# EasyEDA Pro project Demo.eprj

# Schematic Schematic1
Board Name: Board1; Create Date: 2024-12-16; Page Name: P1; Project Name: Demo; Schematic Name: Schematic1; Update Date: 2024-12-16; Company: EasyEDA.com; Page Size: A4; Version: V1.0
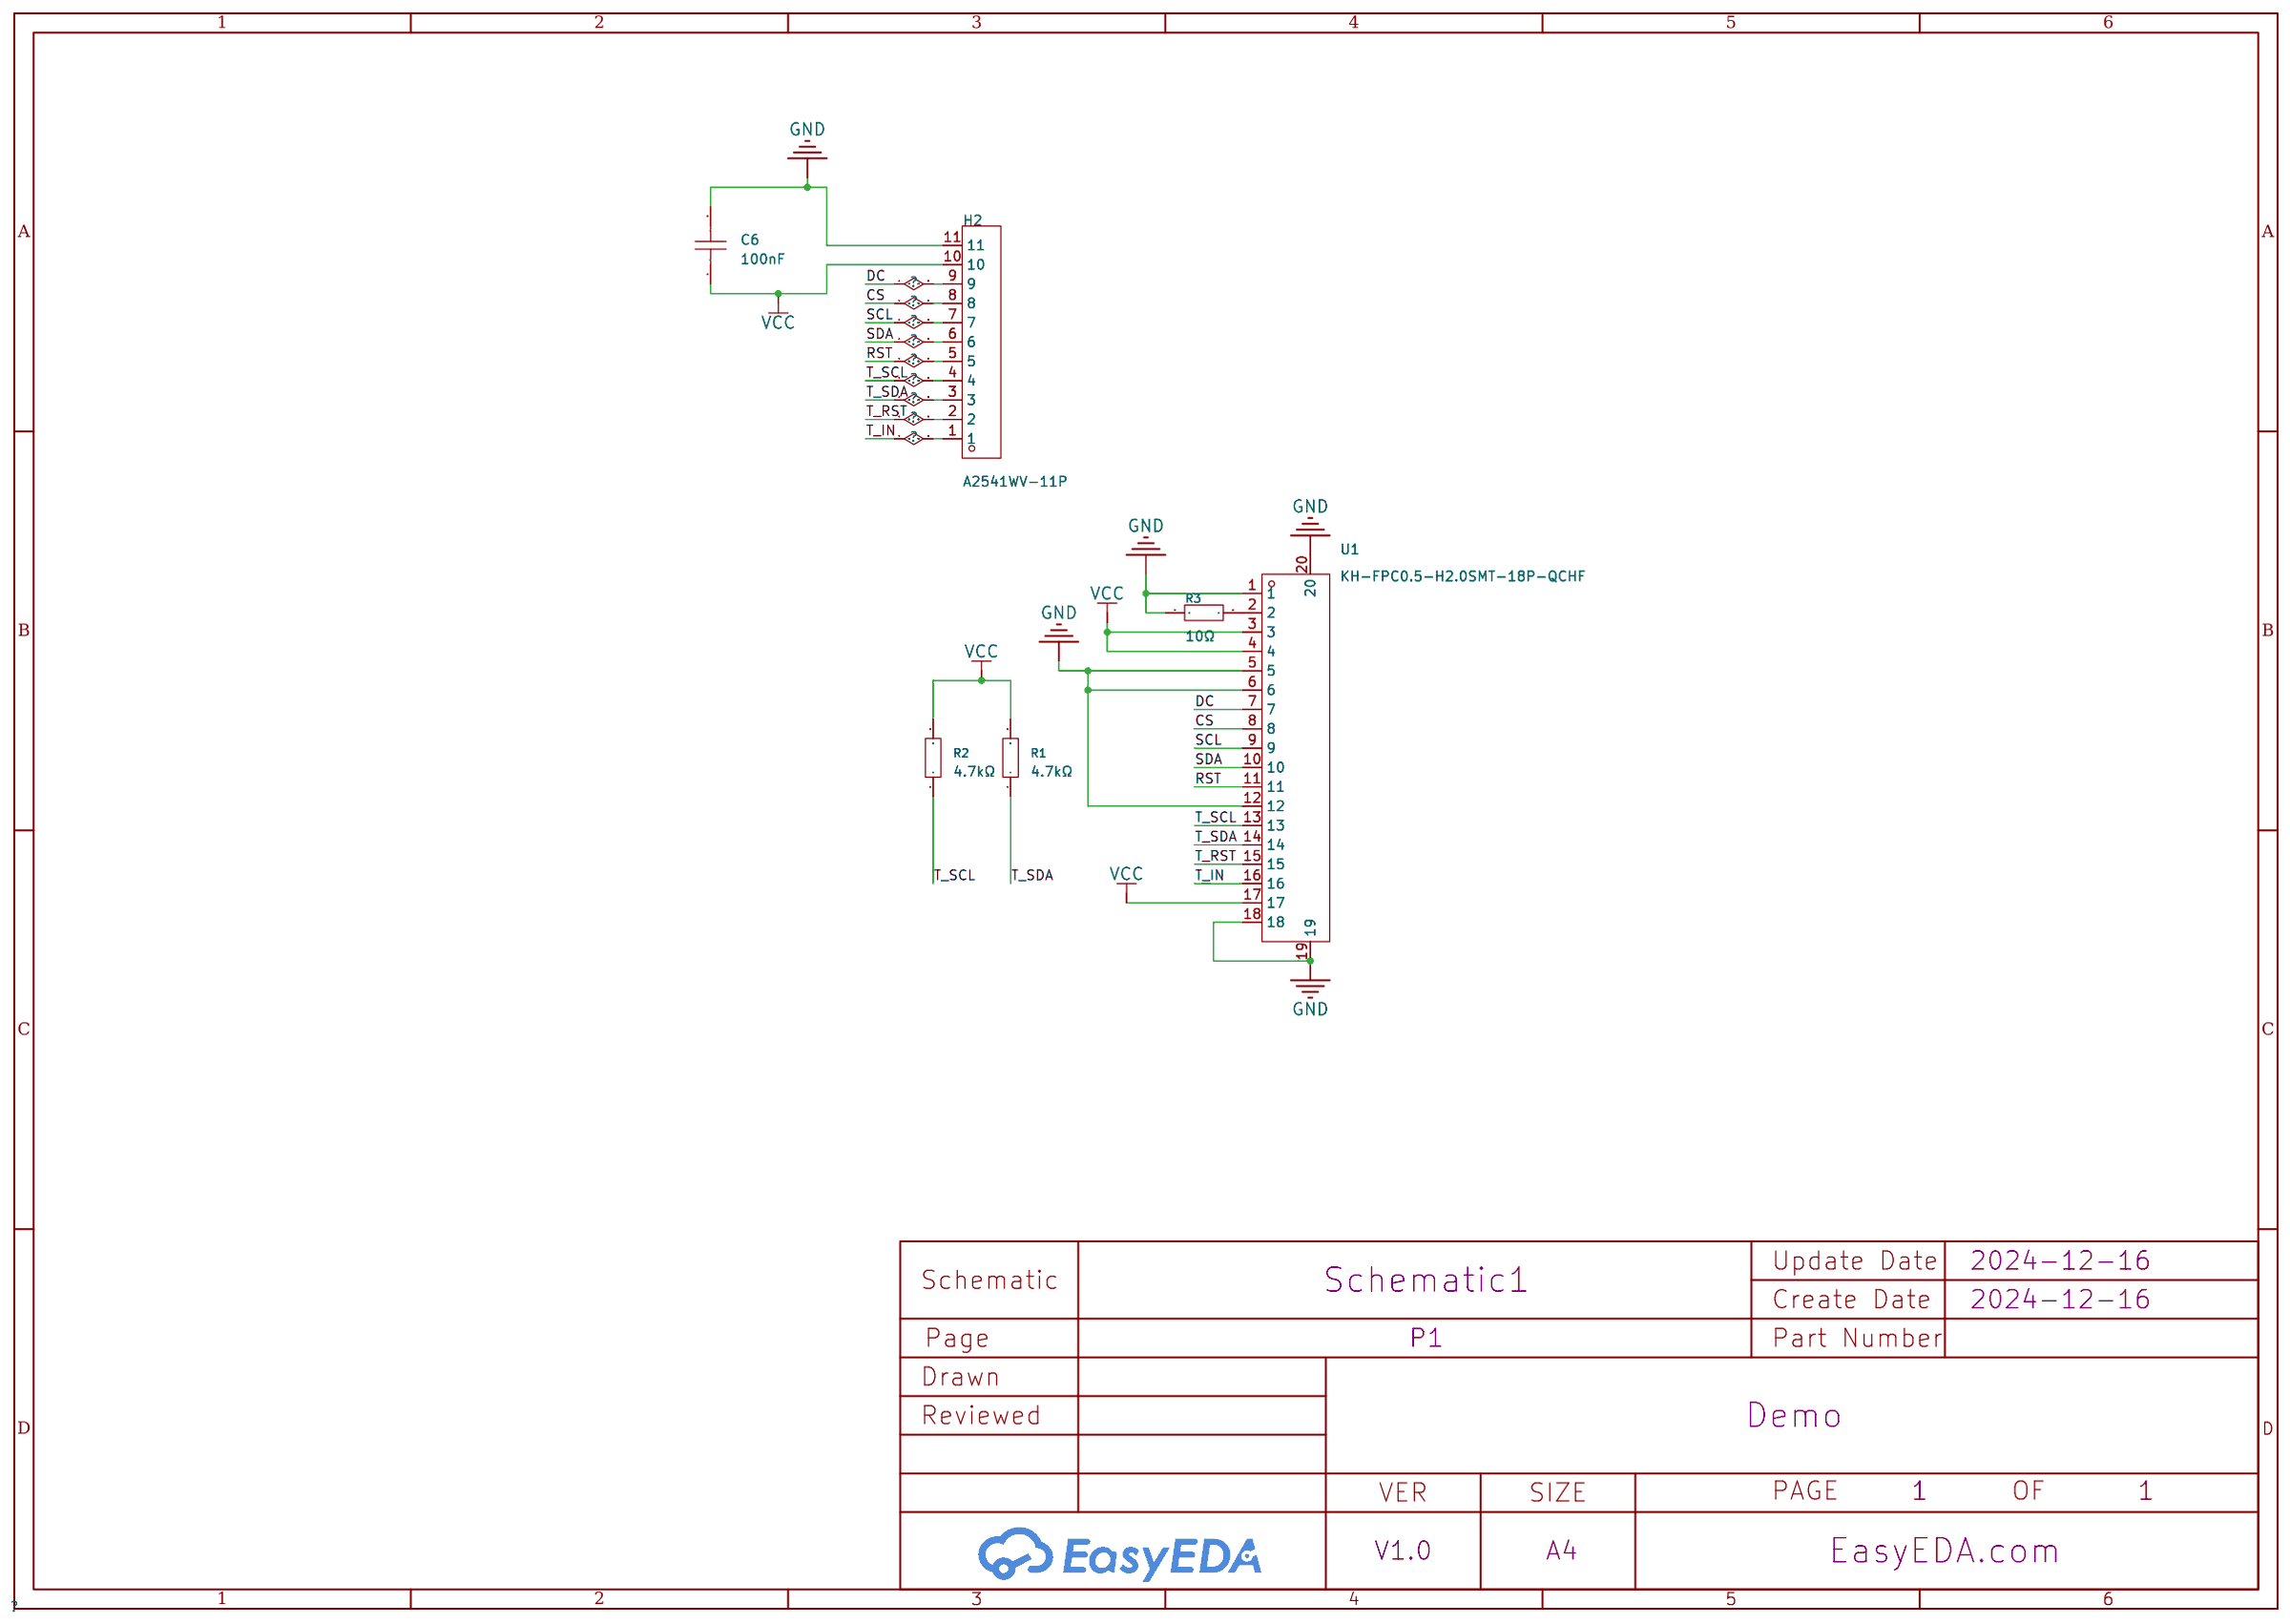
[diagram p0: schematic sheet]

## Parts
C6  100nF  [C0603]
H2  A2541WV-11P  [HDR-TH_11P-P2.54-V-M]
R1  4.7kΩ  [R0603]
R2  4.7kΩ  [R0603]
R3  10Ω  [R0402]
U1  KH-FPC0.5-H2.0SMT-18P-QCHF  [FPC-SMD_18P-P0.50_HDGC_0.5K-DX-18PWBG]

## Library data of the parts
C6 = CGA0603X7R104K500JT: Capacitance:100nF Tolerance:±10% Tolerance:±10% Voltage Rated:50V Temperature Coefficient:; LCSC Part Name: 100nF ±10% 50V; Supplier Part: C6119867; Manufacturer: HRE(芯声); Supplier Footprint: 0603; JLCPCB Part Class: Extended Part; Supplier: LCSC; Tolerance: ±10%; Voltage Rated: 50V
H2 = A2541WV-11P: LCSC Part Name: 1x11P 间距:2.54mm 方针 直插; Supplier Part: C225486; Manufacturer: CJT(长江连接器); Supplier Footprint: 插件,P=2.54mm; JLCPCB Part Class: Extended Part; Datasheet: https://atta.szlcsc.com/upload/public/pdf/source/20180724/C239359_48B1BC0CA1B4E4396A63955AAFD15564.pdf; Supplier: LCSC; Pin Structure: 1x11P; Pitch: 2.54mm; Circluar Pins/Square Pins: Square Pins; Mounting Type: Straight; Number of Rows: Plugin; Number of Pins: 11P; Current Rating (Max): 3A; Voltage Rating (Max): 250V; Length of Mating Pin: 6mm; Insulation Height: 2.54mm; Length of End Connection Pin: 3mm; Contact Plating: Gold; Operating Temperature Range: -40℃~+105℃; Color: Black
R1 R2 = RTT03472JTP: Type:Thick Film Resistors Resistance: Tolerance:±5% Tolerance:±5% Power(Watts): Overload Voltage (Max): Temperature Coefficient:±100ppm/℃ Temperature Coefficient:±100ppm/℃ Operating Temperature Range:-55℃~+155℃ Operating Temperature Range:-55℃~+155℃; LCSC Part Name: 厚膜电阻 4.7kΩ ±5% 100mW; Supplier Part: C103662; Manufacturer: RALEC(旺诠); Supplier Footprint: 0603; JLCPCB Part Class: Extended Part; Datasheet: https://atta.szlcsc.com/upload/public/pdf/source/20191219/C158410_884373A5B7E1BC76BF57BC45A946C093.pdf; Supplier: LCSC; Type: Thick Film Resistors; Tolerance: ±5%; Temperature Coefficient: ±100ppm/℃; Operating Temperature Range: -55℃~+155℃
R3 = RTT02100JTH: LCSC Part Name: 厚膜电阻 10Ω ±5% 62.5mW; Supplier Part: C102753; Manufacturer: RALEC(旺诠); Supplier Footprint: 0402; JLCPCB Part Class: Extended Part; Datasheet: https://atta.szlcsc.com/upload/public/pdf/source/20191219/C158410_884373A5B7E1BC76BF57BC45A946C093.pdf; Supplier: LCSC; Type: Thick Film Resistors; Tolerance: ±5%; Temperature Coefficient: ±100ppm/℃; Operating Temperature Range: -55℃~+155℃
U1 = KH-FPC0.5-H2.0SMT-18P-QCHF: Supplier Part: C3249996; Manufacturer: kinghelm(金航标); Supplier Footprint: SMD,P=0.5mm; JLCPCB Part Class: Extended Part; Datasheet: https://atta.szlcsc.com/upload/public/pdf/source/20220629/0C8C5329E03AE4678B0B24A2A81D42D9.pdf; Supplier: LCSC; Locking Feature: Clamshell; Number of Contacts: 18P; Pitch: 0.5mm; Height Above Board: 2mm

## Nets
GND: C6.2 H2.11 R3.1 U1.1 U1.5 U1.6 U1.12 U1.18 U1.19 U1.20
VCC: C6.1 H2.10 R1.2 R2.2 U1.3 U1.4 U1.17
CS: H2.8 U1.8
DC: H2.9 U1.7
RST: H2.5 U1.11
SCL: H2.7 U1.9
SDA: H2.6 U1.10
T_IN: H2.1 U1.16
T_RST: H2.2 U1.15
T_SCL: H2.4 R2.1 U1.13
T_SDA: H2.3 R1.1 U1.14
Net-(R3-2): R3.2 U1.2

# Board PCB1
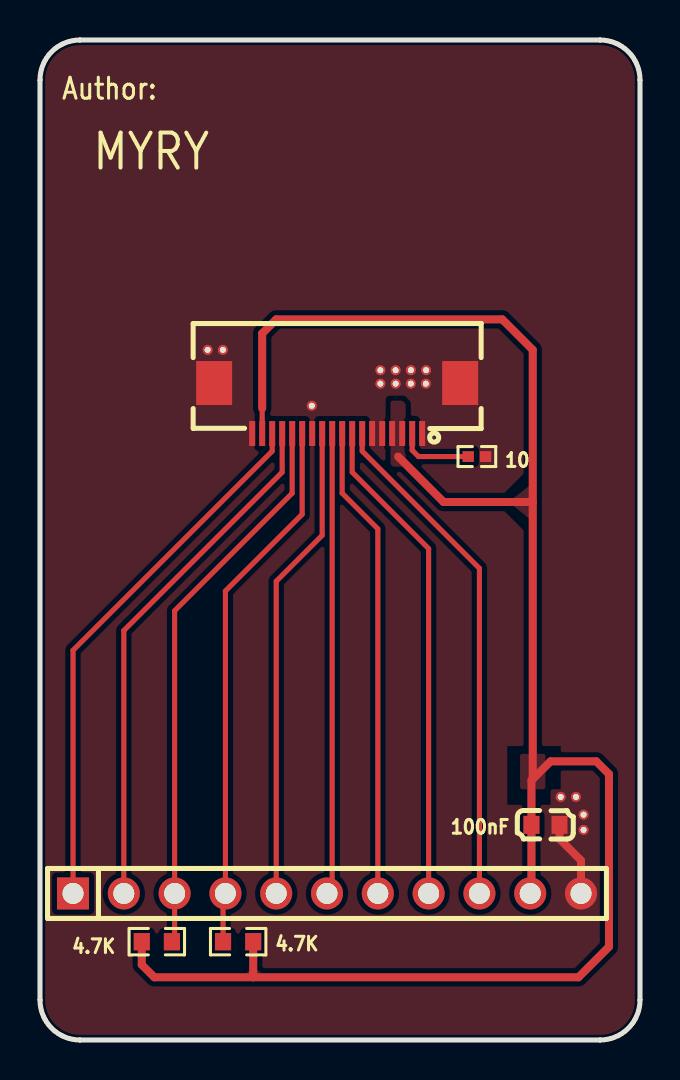
[diagram p1: board, top side]
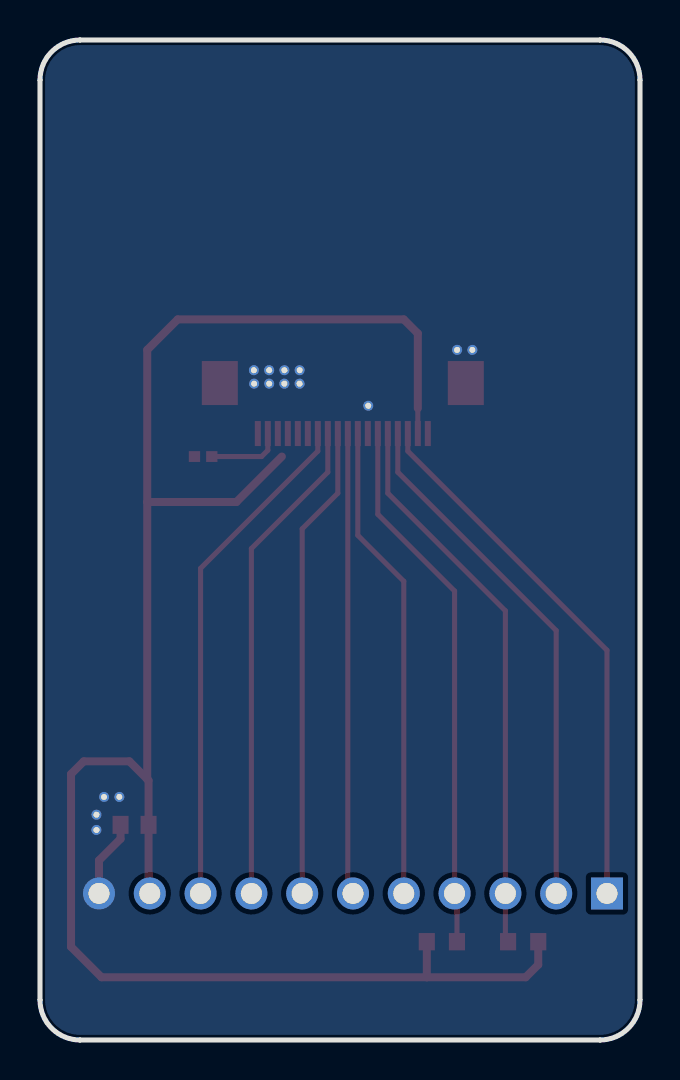
[diagram p2: board, bottom side, seen from below]

Outline 30 x 50 mm; copper layers: Top Layer, Bottom Layer. Coordinates in mm from the lower left corner of the outline.
Outline path: 0,48 0,2 arc(0.59,0.59) 2,0 28,0 arc(29.41,0.59) 30,2 30,48 arc(29.41,49.41) 28,50 2,50 arc(0.59,49.41) 0,48
Stack: Top Layer 0.035mm / Dielectric1 1.51mm FR4 er 4.5 / Bottom Layer 0.035mm

## Design rules (mm)
template: Custom Config
spacing copperThickness1oz (default): track to track 0.102, other pairs 0.152 to 0.3
spacing copperThickness2oz: track to track 0.203, other pairs 0.152 to 0.3
track width copperThickness1oz (default): min 0.127, default 0.254, max 2.54
track width copperThickness2oz: min 0.203, default 0.254, max 2.54
differential pair differentialPair (default): width min 0.127, default 0.254, max 2.54; gap min 0.152, default 0.152
via viaSize (default): diameter min 0.5, default 0.61, max 10; hole min 0.3, default 0.305, max 6.3

## Placement (name value [footprint] x y rotation side)
4.7K  -  [R0603]  5.84 4.91 180 top
4.7K#2  -  [R0603]  9.91 4.91 0 top
10  10Ω  [R0402]  21.84 29.17 180 top
100nF  100nF  [C0603]  25.27 10.76 0 top
H2  A2541WV-11P  [HDR-TH_11P-P2.54-V-M]  14.35 7.33 0 top
NOREF  -  [Pad_e427]  27.18 10.5 0 top
NOREF#2  -  [Pad_e441]  8.38 34.51 0 top
NOREF#3  -  [Pad_e305]  18.54 33.49 0 top
NOREF#4  -  [Pad_e310]  19.29 32.82 0 top
NOREF#5  -  [Pad_e307]  17.02 32.82 0 top
NOREF#6  -  [Pad_e306]  19.3 33.49 0 top
NOREF#7  -  [Pad_e437]  13.59 31.71 0 top
NOREF#8  -  [Pad_e308]  17.78 32.82 0 top
NOREF#9  -  [Pad_e424]  26.03 12.15 0 top
NOREF#10  -  [Pad_e425]  26.8 12.15 0 top
NOREF#11  -  [Pad_e442]  9.14 34.51 0 top
NOREF#12  -  [Pad_e302]  17.02 33.49 0 top
NOREF#13  -  [Pad_e426]  27.18 11.27 0 top
NOREF#14  -  [Pad_e309]  18.54 32.82 0 top
NOREF#15  -  [Pad_e304]  17.78 33.49 0 top
U1  KH-FPC0.5-H2.0SMT-18P-QCHF  [FPC-SMD_18P-P0.50_HDGC_0.5K-DX-18PWBG]  14.86 31.58 180 top

## Footprints (pads in the part's own frame, mm; a bottom-side part is the same pattern mirrored in y, then rotated)
C0603
  rect 0.8x0.9 smd: 1(-0.7,0) 2(0.7,0)
FPC-SMD_18P-P0.50_HDGC_0.5K-DX-18PWBG
  rect 0.3x1.25 smd: 1(-4.25,1.262) 2(-3.75,1.262) 3(-3.25,1.262) 4(-2.75,1.262) 5(-2.25,1.262) 6(-1.75,1.262) 7(-1.25,1.262) 8(-0.75,1.262) 9(-0.25,1.262) 10(0.25,1.262) 11(0.75,1.262) 12(1.25,1.262) 13(1.75,1.262) 14(2.25,1.262) 15(2.75,1.262) 16(3.25,1.262) 17(3.75,1.262) 18(4.25,1.262)
  rect 1.8x2.2 smd: 19(6.15,-1.262) 20(-6.15,-1.262)
HDR-TH_11P-P2.54-V-M
  rect 1.6x1.6 hole 1.05: 1(-12.7,0)
  round 1.6 hole 1.05: 2(-10.16,0) 3(-7.62,0) 4(-5.08,0) 5(-2.54,0) 6(0,0) 7(2.54,0) 8(5.08,0) 9(7.62,0) 10(10.16,0) 11(12.7,0)
Pad_e302
  round 0.5 hole 0.3: 1(0,0)
Pad_e304
  round 0.5 hole 0.3: 1(0,0)
Pad_e305
  round 0.5 hole 0.3: 1(0,0)
Pad_e306
  round 0.5 hole 0.3: 1(0,0)
Pad_e307
  round 0.5 hole 0.3: 1(0,0)
Pad_e308
  round 0.5 hole 0.3: 1(0,0)
Pad_e309
  round 0.5 hole 0.3: 1(0,0)
Pad_e310
  round 0.5 hole 0.3: 1(0,0)
Pad_e424
  round 0.5 hole 0.3: 1(0,0)
Pad_e425
  round 0.5 hole 0.3: 1(0,0)
Pad_e426
  round 0.5 hole 0.3: 1(0,0)
Pad_e427
  round 0.5 hole 0.3: 1(0,0)
Pad_e437
  round 0.5 hole 0.3: 1(0,0)
Pad_e441
  round 0.5 hole 0.3: 1(0,0)
Pad_e442
  round 0.5 hole 0.3: 1(0,0)
R0402
  rect 0.566x0.54 smd: 1(-0.433,0) 2(0.433,0)
R0603
  rect 0.806x0.864 smd: 1(-0.753,0) 2(0.753,0)

## Nets
GND: 10.1 100nF.2 H2.11 NOREF.1 NOREF#2.1 NOREF#3.1 NOREF#4.1 NOREF#5.1 NOREF#6.1 NOREF#7.1 NOREF#8.1 NOREF#9.1 NOREF#10.1 NOREF#11.1 NOREF#12.1 NOREF#13.1 NOREF#14.1 NOREF#15.1 U1.1 U1.5 U1.6 U1.12 U1.18 U1.19 U1.20
VCC: 4.7K.2 4.7K#2.2 100nF.1 H2.10 U1.3 U1.4 U1.17
CS: H2.8 U1.8
DC: H2.9 U1.7
RST: H2.5 U1.11
SCL: H2.7 U1.9
SDA: H2.6 U1.10
T_IN: H2.1 U1.16
T_RST: H2.2 U1.15
T_SCL: 4.7K#2.1 H2.4 U1.13
T_SDA: 4.7K.1 H2.3 U1.14
$1N3250: 10.2 U1.2

## Routing (per net, layer and track width the routed paths; a pad name or vN(x,y) marks a point on that pad's centre or on a via; arc(x,y) is an arc through that point)
GND: length 3.9
  Top Layer w0.4: 100nF.2 25.97,10.06 27.05,8.98 H2.11
VCC: length 94.6
  Top Layer w0.254: 11.11,31.58 U1.17
  Top Layer w0.4: 11.11,31.58 11.11,35.33 11.81,36.03 23.11,36.03 24.64,34.51 24.64,26.9 ; 17.91,29.17 20.18,26.9 24.64,26.9 ; 10.66,3.14 26.92,3.14 28.45,4.66 28.45,13.3 27.81,13.93 25.53,13.93 24.64,13.04 ; 10.66,3.14 4.7K#2.2 ; 10.66,3.14 5.72,3.14 5.09,3.76 4.7K.2 ; 24.64,13.04 24.57,12.98 100nF.1 24.57,7.39 H2.10 ; 24.64,13.04 24.64,26.9
CS: length 24.6
  Top Layer w0.254: U1.8 15.61,28.39 19.43,24.57 H2.8
DC: length 25.4
  Top Layer w0.254: H2.9 21.97,23.58 16.11,29.44 U1.7
RST: length 23.9
  Top Layer w0.254: U1.11 14.11,25.23 11.81,22.94 H2.5
SCL: length 23.7
  Top Layer w0.254: H2.7 16.89,25.56 15.11,27.34 U1.9
SDA: length 23.1
  Top Layer w0.254: U1.10 14.61,7.59 H2.6
T_IN: length 27.1
  Top Layer w0.254: H2.1 1.65,19.49 11.61,29.44 U1.16
T_RST: length 26.3
  Top Layer w0.254: H2.2 4.19,20.47 12.11,28.39 U1.15
T_SCL: length 26.9
  Top Layer w0.254: H2.4 9.27,22.45 13.11,26.29 U1.13 ; 4.7K#2.1 9.15,7.21
T_SDA: length 27.9
  Top Layer w0.254: 4.7K.1 6.73,5.05 H2.3 6.73,21.46 12.61,27.34 U1.14
$1N3250: length 3.8
  Top Layer w0.254: 10.2 18.92,29.17 18.61,29.49 U1.2

## Copper pours and planes (outline as drawn; the poured copper is in the pictures)
GND on Top Layer: 25.53,12.53 25.53,10.05 27.75,10.05 27.75,12.53
GND on Top Layer: -4.44,51.14 33.15,51.14 33.15,-1.44 -4.44,-1.44
GND on Top Layer: 13.46,29.68 13.72,29.68 13.72,31.2 14.1,31.58 14.1,32.23 13.08,32.23 13.08,31.26 13.46,30.88
GND on Top Layer: 16.38,29.68 16.38,34.12 22.36,34.12 22.35,34.12 22.35,31.71 19.56,31.71 19.56,29.55 19.05,29.55 18.92,29.68 18.92,32.21 17.39,32.21 17.27,32.09 17.27,29.62 17.22,29.68
GND on Top Layer: 7.62,35.27 7.62,31.71 9.78,31.71 10.41,31.08 10.41,29.68 10.78,29.68 10.78,31.47 10.16,32.09 10.16,35.27
GND on Bottom Layer: -1.65,51.78 35.94,51.78 35.94,-3.09 -1.65,-3.09
VCC on Top Layer: 17.53,31.97 17.53,28.79 17.65,28.66 18.29,28.66 18.29,31.8 18.11,31.98 18.1,31.97
VCC on Top Layer: 24,14.31 24,12.53 25.27,12.53 25.27,14.31
VCC on Top Layer: 24.64,27.85 23.44,26.9 24.64,25.92

Small or netless copper shapes (teardrops, artwork), in the pictures only: 1 on Top Layer

## Text on the board
Top Silkscreen Layer: Author: | MYRY
